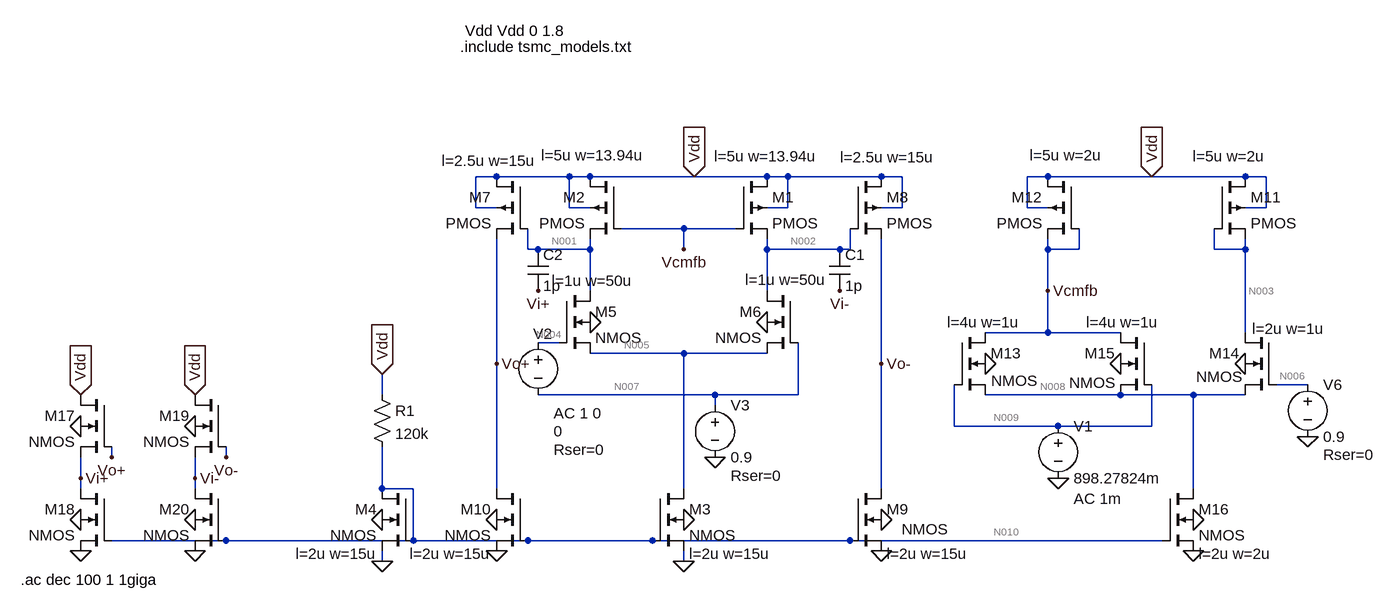
[diagram p0: schematic Q1-S3.asc]
Q1-S3.asc, the LTspice schematic file:
Version 4
SHEET 1 2092 1364
WIRE -80 -240 -112 -240
WIRE 32 -240 -80 -240
WIRE 64 -240 32 -240
WIRE 224 -240 64 -240
WIRE 336 -240 224 -240
WIRE 368 -240 336 -240
WIRE 512 -240 368 -240
WIRE 544 -240 512 -240
WIRE 768 -240 736 -240
WIRE 928 -240 768 -240
WIRE 1072 -240 928 -240
WIRE 1104 -240 1072 -240
WIRE -112 -192 -112 -240
WIRE -80 -192 -112 -192
WIRE 32 -192 32 -240
WIRE 64 -192 32 -192
WIRE 368 -192 368 -240
WIRE 368 -192 336 -192
WIRE 544 -192 544 -240
WIRE 544 -192 512 -192
WIRE 736 -192 736 -240
WIRE 768 -192 736 -192
WIRE 1104 -192 1104 -240
WIRE 1104 -192 1072 -192
WIRE 208 -160 112 -160
WIRE 288 -160 208 -160
WIRE -32 -128 -32 -160
WIRE -16 -128 -32 -128
WIRE 64 -128 64 -144
WIRE 64 -128 -16 -128
WIRE 208 -128 208 -160
WIRE 336 -128 336 -144
WIRE 448 -128 336 -128
WIRE 464 -128 464 -160
WIRE 464 -128 448 -128
WIRE 768 -128 768 -144
WIRE 816 -128 816 -160
WIRE 816 -128 768 -128
WIRE 1024 -128 1024 -160
WIRE 1072 -128 1072 -144
WIRE 1072 -128 1024 -128
WIRE 64 -64 64 -128
WIRE 336 -64 336 -128
WIRE 768 -64 768 -128
WIRE 768 0 768 -64
WIRE 768 0 672 0
WIRE 880 0 768 0
WIRE 1072 0 1072 -128
WIRE 16 16 -16 16
WIRE 208 32 64 32
WIRE 336 32 208 32
WIRE -80 48 -80 -144
WIRE 512 48 512 -144
WIRE 1168 80 1120 80
WIRE -256 96 -256 64
WIRE 256 96 -16 96
WIRE 384 96 384 16
WIRE 384 96 256 96
WIRE 880 96 672 96
WIRE 992 96 880 96
WIRE 1072 96 992 96
WIRE 256 112 256 96
WIRE 624 144 624 80
WIRE 784 144 624 144
WIRE 928 144 928 80
WIRE 928 144 784 144
WIRE -672 192 -672 176
WIRE -496 192 -496 176
WIRE -720 224 -720 192
WIRE -544 224 -544 192
WIRE -720 240 -720 224
WIRE -544 240 -544 224
WIRE -256 240 -256 176
WIRE -208 240 -256 240
WIRE -80 240 -80 48
WIRE 208 240 208 32
WIRE 512 240 512 48
WIRE 992 240 992 96
WIRE -496 320 -672 320
WIRE -208 320 -208 240
WIRE -208 320 -496 320
WIRE -32 320 -208 320
WIRE 160 320 -32 320
WIRE 464 320 160 320
WIRE 944 320 464 320
WIRE -256 352 -256 336
WIRE 208 352 208 336
FLAG -256 352 0
FLAG 208 352 0
FLAG 208 288 0
FLAG -256 288 0
FLAG 256 192 0
FLAG 1168 160 0
FLAG 64 -16 0
FLAG 336 -16 0
FLAG 992 336 0
FLAG 992 288 0
FLAG 224 -240 Vdd
IOPIN 224 -240 In
FLAG 928 -240 Vdd
IOPIN 928 -240 In
FLAG -256 64 Vdd
IOPIN -256 64 In
FLAG 512 288 0
FLAG 512 336 0
FLAG -80 288 0
FLAG -80 336 0
FLAG 208 -128 Vcmfb
FLAG 768 -64 Vcmfb
FLAG -80 48 Vo+
FLAG 512 48 Vo-
FLAG 672 48 0
FLAG 880 48 0
FLAG 1072 48 0
FLAG -720 144 0
FLAG -720 288 0
FLAG -720 336 0
FLAG -720 96 Vdd
IOPIN -720 96 In
FLAG -544 144 0
FLAG -544 288 0
FLAG -544 336 0
FLAG -544 96 Vdd
IOPIN -544 96 In
FLAG 784 224 0
FLAG -672 192 Vo+
FLAG -496 192 Vo-
FLAG -720 224 Vi+
FLAG -16 -64 Vi+
FLAG -544 224 Vi-
FLAG 448 -64 Vi-
DATAFLAG 512 -80 ""
DATAFLAG -80 -64 ""
DATAFLAG 400 -128 ""
DATAFLAG 1072 -80 ""
DATAFLAG 208 -160 ""
SYMBOL pmos4 288 -240 R0
WINDOW 123 -33 -31 Left 2
SYMATTR Value2 l=5u w=13.94u
SYMATTR InstName M1
SYMBOL pmos4 112 -240 M0
WINDOW 123 -36 -33 Left 2
SYMATTR Value2 l=5u w=13.94u
SYMATTR InstName M2
SYMBOL nmos4 160 240 R0
WINDOW 123 56 100 Left 2
SYMATTR Value2 l=2u w=15u
SYMATTR InstName M3
SYMBOL nmos4 -208 240 M0
WINDOW 123 56 100 Left 2
SYMATTR Value2 l=2u w=15u
SYMATTR InstName M4
SYMBOL nmos4 16 -64 R0
WINDOW 123 -11 -16 Left 2
SYMATTR Value2 l=1u w=50u
SYMATTR InstName M5
SYMBOL nmos4 384 -64 M0
WINDOW 123 -44 -17 Left 2
SYMATTR Value2 l=1u w=50u
SYMATTR InstName M6
SYMBOL res -272 80 R0
SYMATTR InstName R1
SYMATTR Value 120k
SYMBOL voltage -16 0 R0
WINDOW 0 -8 2 Left 2
WINDOW 123 24 124 Left 2
WINDOW 39 24 180 Left 2
WINDOW 3 24 152 Left 2
SYMATTR InstName V2
SYMATTR Value2 AC 1 0
SYMATTR SpiceLine Rser=0
SYMATTR Value 0
SYMBOL voltage 256 96 R0
WINDOW 123 0 0 Left 2
WINDOW 39 24 124 Left 2
SYMATTR SpiceLine Rser=0
SYMATTR InstName V3
SYMATTR Value 0.9
SYMBOL pmos4 -32 -240 M0
WINDOW 123 -13 -24 Left 2
SYMATTR Value2 l=2.5u w=15u
SYMATTR InstName M7
SYMBOL pmos4 464 -240 R0
WINDOW 123 -15 -30 Left 2
SYMATTR Value2 l=2.5u w=15u
SYMATTR InstName M8
SYMBOL nmos4 464 240 R0
WINDOW 123 56 100 Left 2
WINDOW 3 79 63 Left 2
SYMATTR Value2 l=2u w=15u
SYMATTR InstName M9
SYMBOL nmos4 -32 240 M0
WINDOW 123 56 100 Left 2
SYMATTR Value2 l=2u w=15u
SYMATTR InstName M10
SYMBOL pmos4 1024 -240 R0
WINDOW 123 -33 -31 Left 2
SYMATTR Value2 l=5u w=2u
SYMATTR InstName M11
SYMBOL pmos4 816 -240 M0
WINDOW 123 -36 -33 Left 2
SYMATTR Value2 l=5u w=2u
SYMATTR InstName M12
SYMBOL nmos4 624 0 R0
WINDOW 123 -11 -16 Left 2
WINDOW 3 57 74 Left 2
SYMATTR Value2 l=4u w=1u
SYMATTR InstName M13
SYMBOL nmos4 1120 0 M0
WINDOW 123 -74 -6 Left 2
WINDOW 3 52 68 Left 2
SYMATTR Value2 l=2u w=1u
SYMATTR InstName M14
SYMBOL voltage 1168 64 R0
WINDOW 123 0 0 Left 2
WINDOW 39 24 124 Left 2
SYMATTR SpiceLine Rser=0
SYMATTR InstName V6
SYMATTR Value 0.9
SYMBOL nmos4 928 0 M0
WINDOW 123 -11 -16 Left 2
WINDOW 3 55 77 Left 2
SYMATTR Value2 l=4u w=1u
SYMATTR InstName M15
SYMBOL nmos4 944 240 R0
WINDOW 123 56 100 Left 2
SYMATTR Value2 l=2u w=2u
SYMATTR InstName M16
SYMBOL nmos4 -672 96 M0
SYMATTR InstName M17
SYMBOL nmos4 -672 240 M0
SYMATTR InstName M18
SYMATTR Value2 l=2u w=50u
SYMBOL nmos4 -496 96 M0
SYMATTR InstName M19
SYMBOL nmos4 -496 240 M0
SYMATTR InstName M20
SYMATTR Value2 l=2u w=50u
SYMBOL voltage 784 128 R0
WINDOW 123 24 128 Left 2
WINDOW 39 0 0 Left 2
SYMATTR InstName V1
SYMATTR Value 898.27824m
SYMATTR Value2 AC 1m
SYMBOL cap 432 -128 R0
SYMATTR InstName C1
SYMATTR Value 1p
SYMBOL cap -32 -128 R0
SYMATTR InstName C2
SYMATTR Value 1p
TEXT -136 -440 Left 2 !.include tsmc_models.txt
TEXT -128 -464 Left 2 !Vdd Vdd 0 1.8
TEXT -812 380 Left 2 !.ac dec 100 1 1giga

The netlist it stands for:
* Q1-S3.asc
M1 Vdd Vcmfb N002 Vdd PMOS l=5u w=13.94u
M2 Vdd Vcmfb N001 Vdd PMOS l=5u w=13.94u
M3 N005 N010 0 0 NMOS l=2u w=15u
M4 N010 N010 0 0 NMOS l=2u w=15u
M5 N001 N004 N005 0 NMOS l=1u w=50u
M6 N002 N007 N005 0 NMOS l=1u w=50u
R1 Vdd N010 120k
V2 N004 N007 0 AC 1 0 Rser=0
V3 N007 0 0.9 Rser=0
M7 Vdd N001 Vo+ Vdd PMOS l=2.5u w=15u
M8 Vdd N002 Vo- Vdd PMOS l=2.5u w=15u
M9 Vo- N010 0 0 NMOS l=2u w=15u
M10 Vo+ N010 0 0 NMOS l=2u w=15u
M11 Vdd N003 N003 Vdd PMOS l=5u w=2u
M12 Vdd Vcmfb Vcmfb Vdd PMOS l=5u w=2u
M13 Vcmfb N009 N008 0 NMOS l=4u w=1u
M14 N003 N006 N008 0 NMOS l=2u w=1u
V6 N006 0 0.9 Rser=0
M15 Vcmfb N009 N008 0 NMOS l=4u w=1u
M16 N008 N010 0 0 NMOS l=2u w=2u
M17 Vdd Vo+ Vi+ 0 NMOS
M18 Vi+ N010 0 0 NMOS l=2u w=50u
M19 Vdd Vo- Vi- 0 NMOS
M20 Vi- N010 0 0 NMOS l=2u w=50u
V1 N009 0 898.27824m AC 1m
C1 N002 Vi- 1p
C2 N001 Vi+ 1p
.model NMOS NMOS
.model PMOS PMOS
.lib standard.mos
.include tsmc_models.txt
Vdd Vdd 0 1.8
.ac dec 100 1 1giga
.backanno
.end

* Results of the author's LTspice run, read from the files saved beside the schematic
* Operating Point, zero values left out:
*   V(vdd) = 1.8 V
*   V(vcmfb) = 1.126 V
*   V(n002) = 1.129 V
*   V(n001) = 1.129 V
*   V(n005) = 384.4 mV
*   V(n010) = 516.1 mV
*   V(n004) = 900 mV
*   V(n007) = 900 mV
*   V(vo+) = 900 mV
*   V(vo-) = 900 mV
*   V(n003) = 1.146 V
*   V(n009) = 898.3 mV
*   V(n008) = 308.1 mV
*   V(n006) = 900 mV
*   V(vi+) = 48.87 mV
*   V(vi-) = 48.87 mV
*   Id(M20) = 23.07 µA
*   Is(M20) = -23.07 µA
*   Id(M19) = 23.07 µA
*   Ib(M19) = -1.867 pA
*   Is(M19) = -23.07 µA
*   Id(M18) = 23.07 µA
*   Is(M18) = -23.07 µA
*   Id(M17) = 23.07 µA
*   Ib(M17) = -1.867 pA
*   Is(M17) = -23.07 µA
*   Id(M16) = 1.38 µA
*   Is(M16) = -1.38 µA
*   Id(M15) = 371.1 nA
*   Ib(M15) = -1.454 pA
*   Is(M15) = -371.1 nA
*   Id(M14) = 637.5 nA
*   Ib(M14) = -1.474 pA
*   Is(M14) = -637.5 nA
*   Id(M13) = 371.1 nA
*   Ib(M13) = -1.454 pA
*   Is(M13) = -371.1 nA
*   Id(M10) = 10.94 µA
*   Is(M10) = -10.94 µA
*   Id(M9) = 10.94 µA
*   Is(M9) = -10.94 µA
*   Id(M6) = 5.306 µA
*   Ib(M6) = -1.533 pA
*   Is(M6) = -5.306 µA
*   Id(M5) = 5.306 µA
*   Ib(M5) = -1.533 pA
*   Is(M5) = -5.306 µA
*   Id(M4) = 10.7 µA
*   Is(M4) = -10.7 µA
*   Id(M3) = 10.61 µA
*   Is(M3) = -10.61 µA
*   Id(M12) = 742.3 nA
*   Is(M12) = -742.3 nA
*   Id(M11) = 637.5 nA
*   Is(M11) = -637.5 nA
*   Id(M8) = 10.94 µA
*   Is(M8) = -10.94 µA
*   Id(M7) = 10.94 µA
*   Is(M7) = -10.94 µA
*   Id(M2) = 5.306 µA
*   Is(M2) = -5.306 µA
*   Id(M1) = 5.306 µA
*   Is(M1) = -5.306 µA
*   I(R1) = 10.7 µA
*   I(Vdd) = -90.71 µA
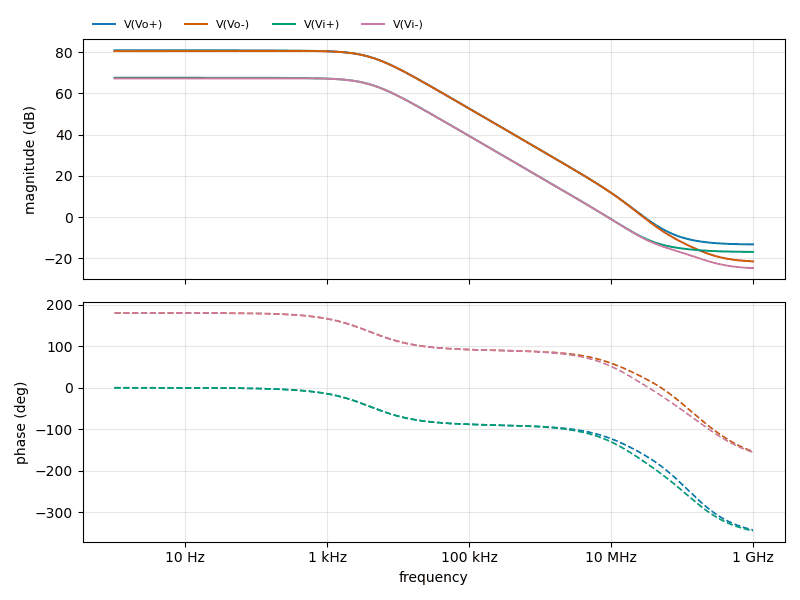
[diagram p1: AC Analysis of Q1-S3.asc, plotted from the saved traces]
* AC Analysis, 1 run:
*   V(Vo+): 80.86 dB at 1 Hz, -13.26 dB at 1 GHz, peak 80.86 dB at 1 Hz, 3 dB below the peak at 3.796 kHz
*   V(Vo-): 80.49 dB at 1 Hz, -21.49 dB at 1 GHz, peak 80.56 dB at 380.2 Hz, 3 dB below the peak at 4.042 kHz
*   V(Vi+): 67.57 dB at 1 Hz, -16.90 dB at 1 GHz, peak 67.57 dB at 1 Hz, 3 dB below the peak at 3.796 kHz
*   V(Vi-): 67.20 dB at 1 Hz, -24.78 dB at 1 GHz, peak 67.27 dB at 380.2 Hz, 3 dB below the peak at 4.042 kHz